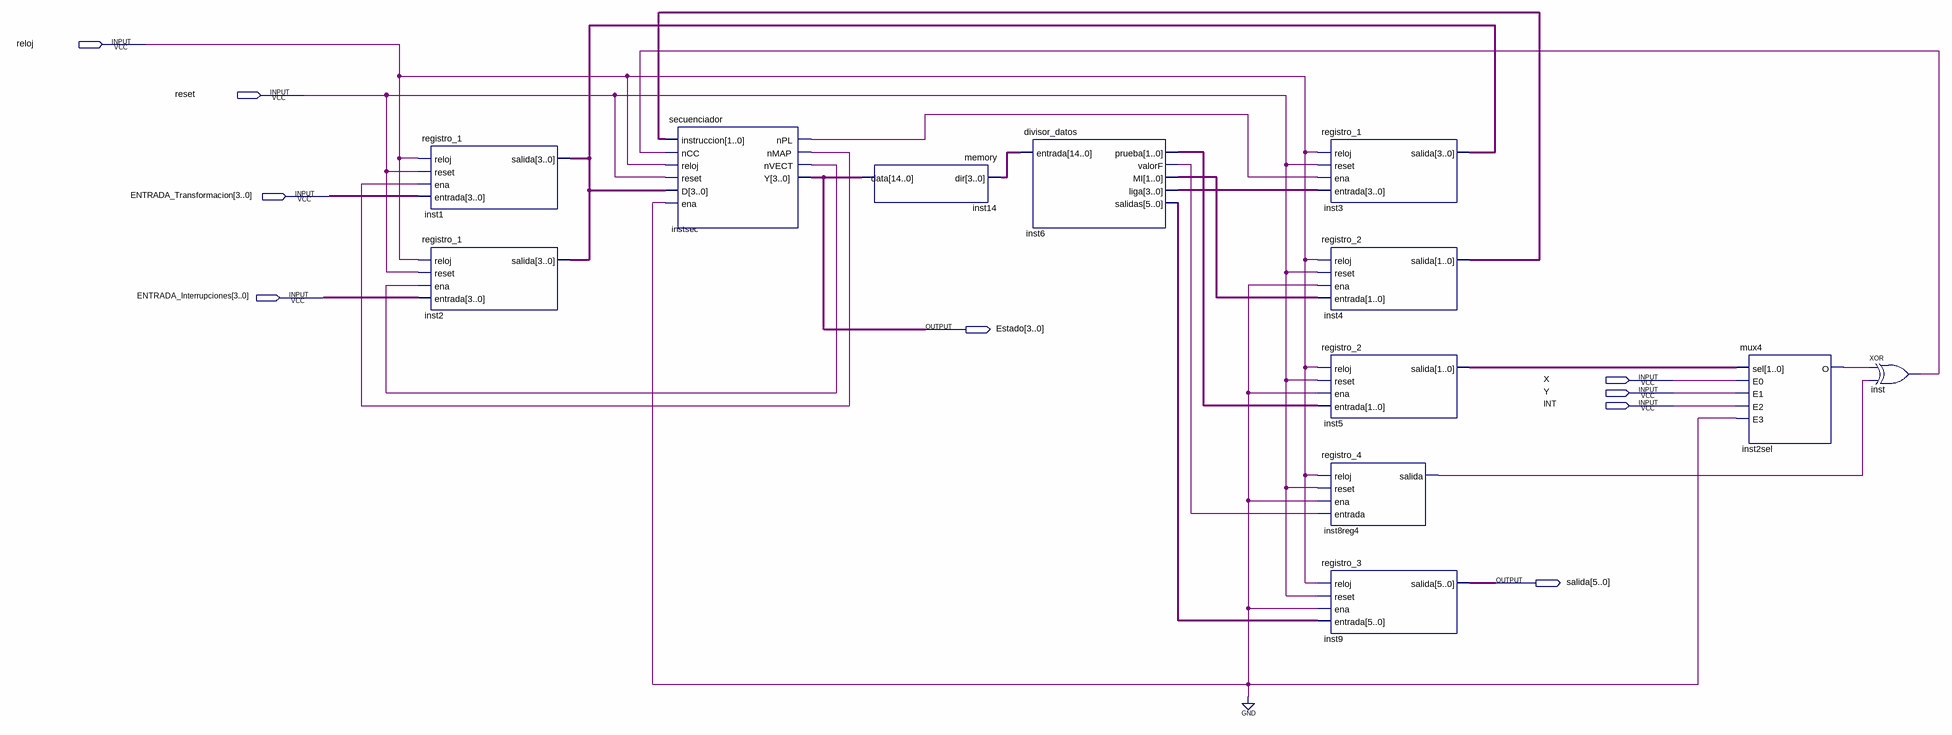
[diagram p0: schematic sheet]
// Quartus schematic practica6.bdf as structural Verilog: 12 symbols, 9 pins
module practica6 (
  input  reloj,
  input  reset,
  input  [3:0] ENTRADA_Transformacion,
  input  [3:0] ENTRADA_Interrupciones,
  input  X,
  input  Y,
  input  INT,
  output [3:0] Estado,
  output [5:0] salida
);

  wire inst2sel_o, inst6_valorf, inst8reg4_salida, inst_out, instsec_nmap, instsec_npl, instsec_nvect;
  wire [1:0] inst4_salida, inst5_salida, inst6_mi, inst6_prueba;
  wire [3:0] inst1_salida, inst6_liga;
  wire [5:0] inst6_salidas;
  wire [14:0] undriven;

  registro_1 inst1 (
    .reloj(reloj), .reset(reset), .ena(instsec_nmap), .entrada(ENTRADA_Transformacion), .salida(inst1_salida));
  registro_1 inst2 (
    .reloj(reloj), .reset(reset), .ena(instsec_nvect), .entrada(ENTRADA_Interrupciones), .salida(inst1_salida));
  secuenciador instsec (
    .instruccion(inst4_salida), .nCC(inst_out), .reloj(reloj), .reset(reset), .D(inst1_salida), .ena(1'b0),
    .nPL(instsec_npl), .nMAP(instsec_nmap), .nVECT(instsec_nvect), .Y(Estado));
  memory inst14 (.dir(undriven), .data(Estado));
  divisor_datos inst6 (
    .entrada(undriven), .prueba(inst6_prueba), .valorF(inst6_valorf), .MI(inst6_mi), .liga(inst6_liga),
    .salidas(inst6_salidas));
  registro_1 inst3 (.reloj(reloj), .reset(reset), .ena(instsec_npl), .entrada(inst6_liga), .salida(inst1_salida));
  registro_2 inst4 (.reloj(reloj), .reset(reset), .ena(1'b0), .entrada(inst6_mi), .salida(inst4_salida));
  registro_2 inst5 (.reloj(reloj), .reset(reset), .ena(1'b0), .entrada(inst6_prueba), .salida(inst5_salida));
  registro_4 inst8reg4 (.reloj(reloj), .reset(reset), .ena(1'b0), .entrada(inst6_valorf), .salida(inst8reg4_salida));
  registro_3 inst9 (.reloj(reloj), .reset(reset), .ena(1'b0), .entrada(inst6_salidas), .salida(salida));
  mux4 inst2sel (.sel(inst5_salida), .E0(X), .E1(Y), .E2(INT), .E3(1'b0), .O(inst2sel_o));
  xor inst (inst_out, inst2sel_o, inst8reg4_salida);
endmodule
